# Altium schematic sheet adc_buffer.SchDoc
size A4
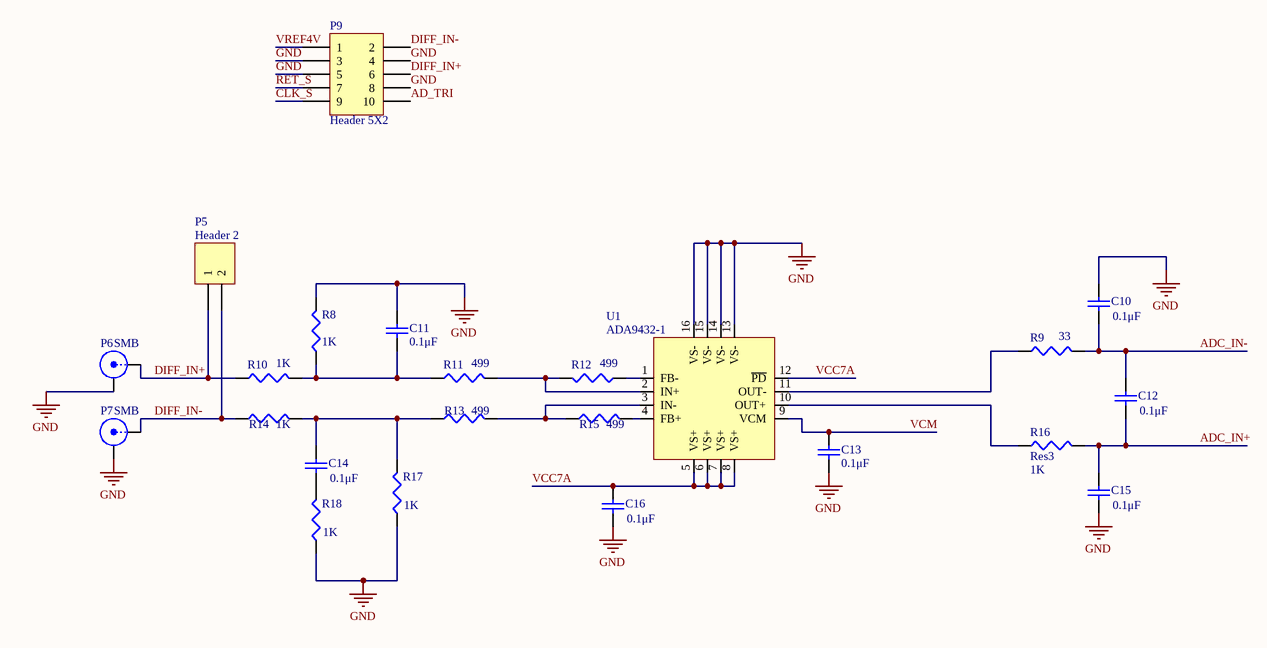
[diagram p0: adc_buffer.SchDoc]

## Parts
C10  value 0.1μF  [1608[0603]]  (hidden comment: Cap Semi)
C11  value 0.1μF  [1608[0603]]  (hidden comment: Cap Semi)
C12  value 0.1μF  [1608[0603]]  (hidden comment: Cap Semi)
C13  value 0.1μF  [1608[0603]]  (hidden comment: Cap Semi)
C14  value 0.1μF  [1608[0603]]  (hidden comment: Cap Semi)
C15  value 0.1μF  [1608[0603]]  (hidden comment: Cap Semi)
C16  value 0.1μF  [1608[0603]]  (hidden comment: Cap Semi)
P5  Header 2  [HDR1X2]
P6  SMB  [SMB_V-RJ45]
P7  SMB  [SMB_V-RJ45]
P9  Header 5X2  [HDR2X5]
R8  value 1K  [J1-0603]  (hidden comment: Res3)
R9  value 33  [J1-0603]  (hidden comment: Res3)
R10  value 1K  [J1-0603]  (hidden comment: Res3)
R11  value 499  [J1-0603]  (hidden comment: Res3)
R12  value 499  [J1-0603]  (hidden comment: Res3)
R13  value 499  [J1-0603]  (hidden comment: Res3)
R14  value 1K  [J1-0603]  (hidden comment: Res3)
R15  value 499  [J1-0603]  (hidden comment: Res3)
R16  Res3  value 1K  [J1-0603]
R17  value 1K  [J1-0603]  (hidden comment: Res3)
R18  value 1K  [J1-0603]  (hidden comment: Res3)
U1  ADA9432-1  [QFN50P300X300X100VQ-17N]

## Nets
GND: C10.2 C11.2 C13.1 C15.1 C16.1 P6.2(Y) P7.2(Y) P9.3 P9.4 P9.5 P9.8 R8.2 R17.1 R18.1 U1.13(VS-) U1.14(VS-) U1.15(VS-) U1.16(VS-)
AD_TRI: P9.10
ADC_IN+: C12.1 C15.2 R16.2
ADC_IN-: C10.1 C12.2 R9.2
CLK_S: P9.9
DIFF_IN+: P5.1 P6.1(X) P9.6 R10.1
DIFF_IN-: P5.2 P7.1(X) P9.2 R14.1
RET_S: P9.7
VCC7A: C16.2 U1.5(VS+) U1.6(VS+) U1.7(VS+) U1.8(VS+) U1.12(~{PD})
VCM: C13.2 U1.9(VCM)
VREF4V: P9.1
NetC11_1: C11.1 R8.1 R10.2 R11.1
NetC14_1: C14.1 R18.2
NetC14_2: C14.2 R13.1 R14.2 R17.2
NetR9_1: R9.1 U1.11(OUT-)
NetR11_2: R11.2 R12.2 U1.2(IN+)
NetR12_1: R12.1 U1.1(FB-)
NetR13_2: R13.2 R15.1 U1.3(IN-)
NetR15_2: R15.2 U1.4(FB+)
NetR16_1: R16.1 U1.10(OUT+)

## Library data of the parts
C10-C16 = Cap Semi: Capacitor (Semiconductor SIM Model); Published: 8-Jun-2000; LatestRevisionDate: 29-May-2009; LatestRevisionNote: IPC-7351 Footprint Added.; PackageReference: C1206; Publisher: Altium Limited; PackageDescription: Chip Capacitor
P5 = Header 2: Header, 2-Pin; LatestRevisionDate: 17-Jul-2002; LatestRevisionNote: Re-released for DXP Platform.; Publisher: Altium Limited
P6 P7 = SMB: SMB Straight Connector; LatestRevisionDate: 17-Jul-2002; LatestRevisionNote: Re-released for DXP Platform.; Publisher: Altium Limited
P9 = Header 5X2: Header, 5-Pin, Dual row; LatestRevisionDate: 17-Jul-2002; LatestRevisionNote: Re-released for DXP Platform.; Publisher: Altium Limited
R8-R18 = Res3: Resistor; Published: 8-Jun-2000; LatestRevisionDate: 29-May-2009; LatestRevisionNote: IPC-7351 Footprint Added.; PackageReference: J1-0603; Publisher: Altium Limited; PackageDescription: Chip Resistor